# Altium schematic sheet SPI Output.SchDoc: SPI Output
size 203 x 127 mm; DrawnBy: Kace Chandler; DocumentNumber: 19; SheetNumber: 19; SheetTotal: 23
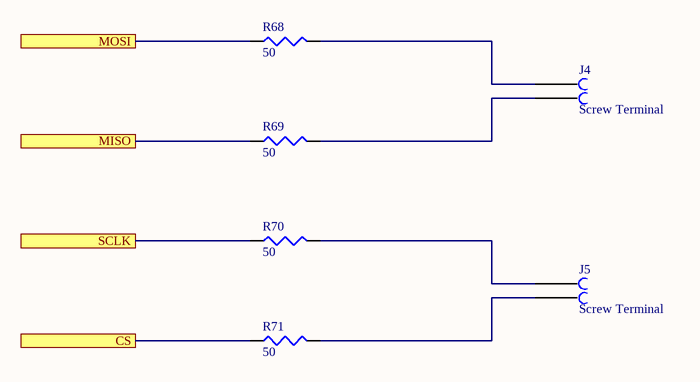
[diagram p0: SPI Output.SchDoc]

## Parts
J4  Screw Terminal  [Screw Terminal]
J5  Screw Terminal  [Screw Terminal]
R68  value 50  [0603 Footprint]  (hidden comment: Res3)
R69  value 50  [0603 Footprint]  (hidden comment: Res3)
R70  value 50  [0603 Footprint]  (hidden comment: Res3)
R71  value 50  [0603 Footprint]  (hidden comment: Res3)

## Ports
CS, MISO, MOSI, SCLK

## Nets
CS: R71.1 ; port CS
MISO: R69.1 ; port MISO
MOSI: R68.1 ; port MOSI
SCLK: R70.1 ; port SCLK
NetJ4_1: J4.1 R68.2
NetJ4_2: J4.2 R69.2
NetJ5_1: J5.1 R70.2
NetJ5_2: J5.2 R71.2

## Library data of the parts
R68-R71 = Res3: Resistor; Published: 8-Jun-2000; LatestRevisionDate: 29-May-2009; LatestRevisionNote: IPC-7351 Footprint Added.; PackageReference: J1-0603; Publisher: Altium Limited; PackageDescription: Chip Resistor
J4 J5 = Screw Terminal: Supplier 1: Digi-Key; Supplier Part Number 1: A112762-ND